# Altium schematic sheet ARM.SchDoc
size A4; DocumentNumber: 12; SheetNumber: 12; SheetTotal: 34
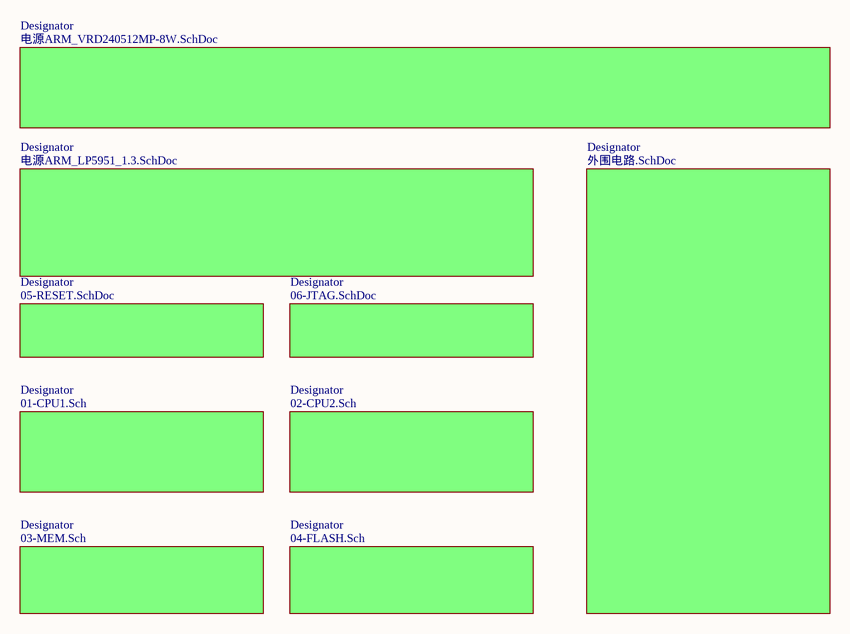
[diagram p0: ARM.SchDoc]

## Sub-sheets
Designator = 01-CPU1.Sch: no entries
Designator = 02-CPU2.Sch: no entries
Designator = 03-MEM.Sch: no entries
Designator = 04-FLASH.Sch: no entries
Designator = 电源ARM_LP5951_1.3.SchDoc: no entries
Designator = 06-JTAG.SchDoc: no entries
Designator = 05-RESET.SchDoc: no entries
Designator = 电源ARM_VRD240512MP-8W.SchDoc: no entries
Designator = 外围电路.SchDoc: no entries